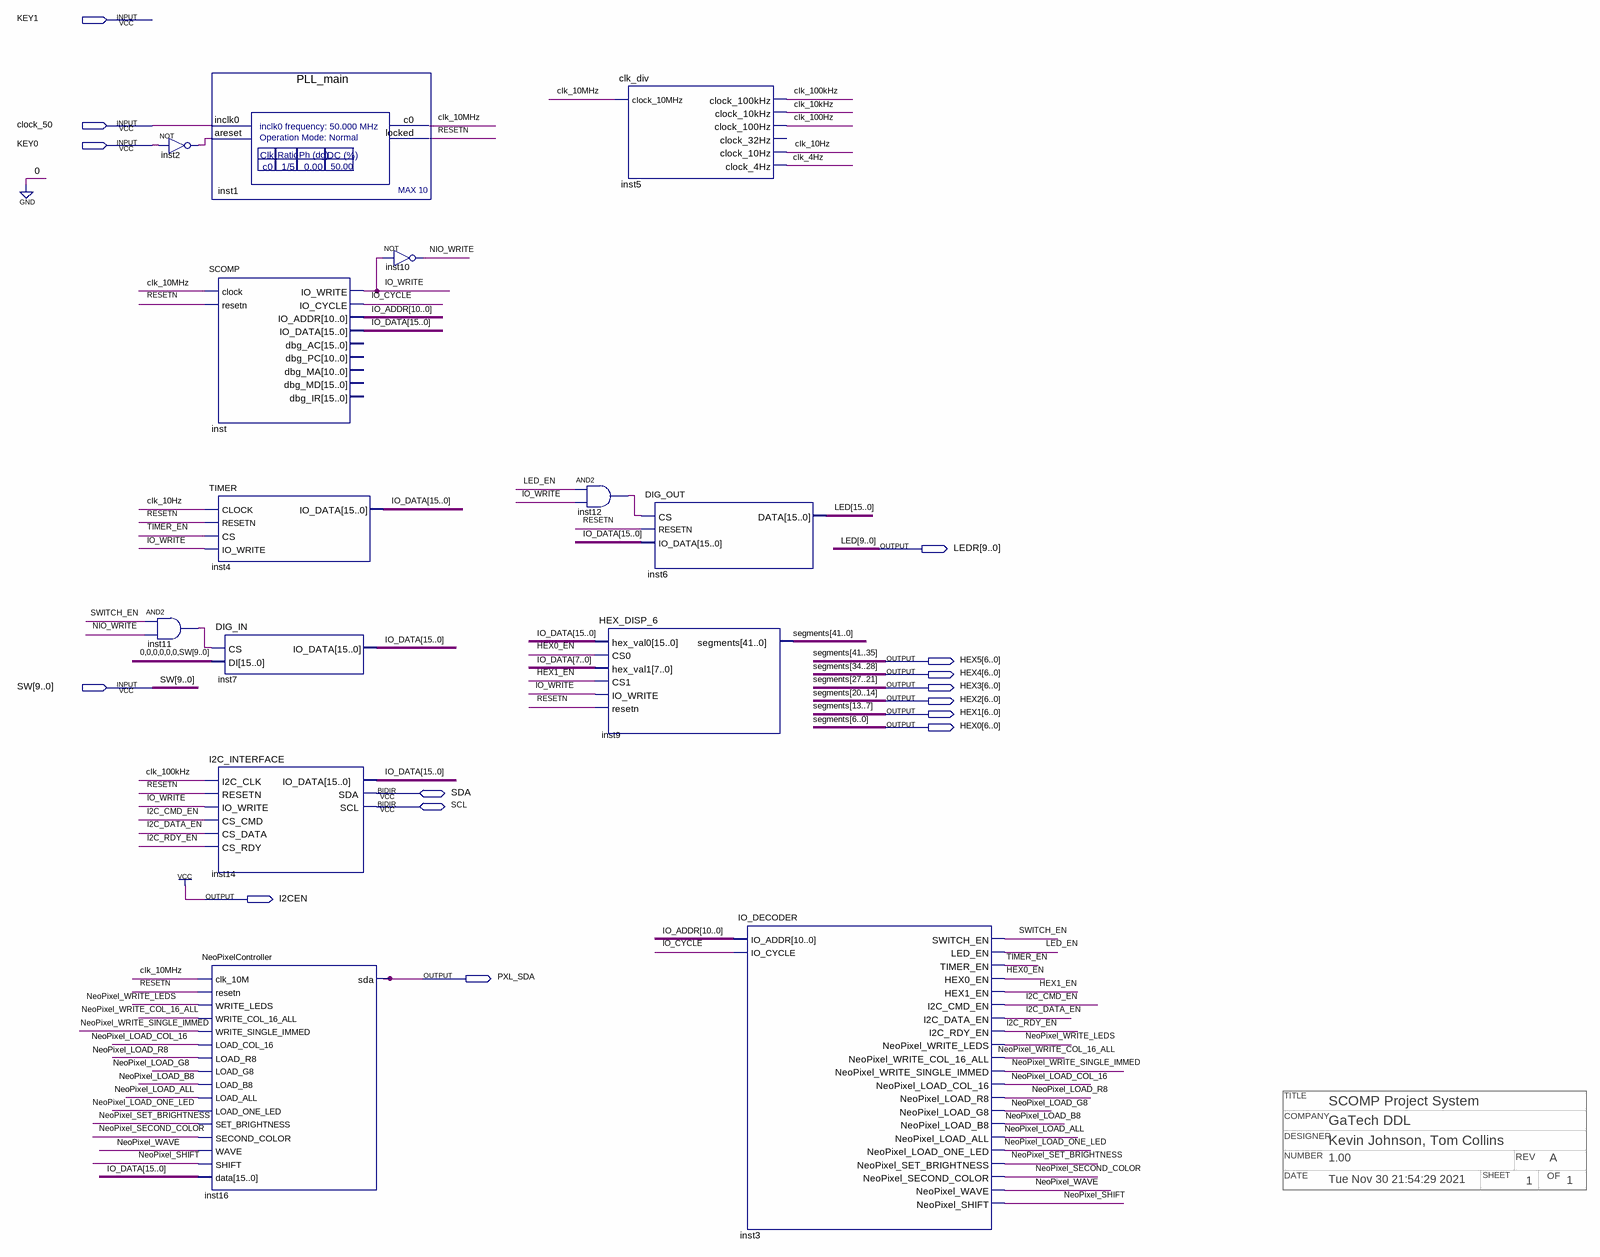
[diagram p0: schematic sheet]
// Quartus schematic SCOMP_System.bdf as structural Verilog: 14 symbols, 15 pins
// Title block: COMPANY: GaTech DDL; DATE: Tue Nov 30 21:54:29 2021; DESIGNER: Kevin Johnson, Tom Collins; NUMBER: 1.00; OF: 1; REV: A; SHEET: 1; TITLE: SCOMP Project System
module SCOMP_System (
  input  KEY1,
  input  clock_50,
  input  KEY0,
  input  [9:0] SW,
  inout  SDA,
  inout  SCL,
  output [9:0] LEDR,
  output [6:0] HEX5,
  output [6:0] HEX4,
  output [6:0] HEX3,
  output [6:0] HEX2,
  output [6:0] HEX1,
  output [6:0] HEX0,
  output I2CEN,
  output PXL_SDA
);

  wire clk_4Hz, clk_10Hz, clk_10kHz, clk_10MHz, clk_100Hz, clk_100kHz, HEX0_EN, HEX1_EN, I2C_CMD_EN,
       I2C_DATA_EN, I2C_RDY_EN, inst2_out, inst11_out, inst12_out, IO_CYCLE, IO_WRITE, LED_EN,
       NeoPixel_LOAD_ALL, NeoPixel_LOAD_B8, NeoPixel_LOAD_COL_16, NeoPixel_LOAD_G8, NeoPixel_LOAD_ONE_LED,
       NeoPixel_LOAD_R8, NeoPixel_SECOND_COLOR, NeoPixel_SET_BRIGHTNESS, NeoPixel_SHIFT, NeoPixel_WAVE,
       NeoPixel_WRITE_COL_16_ALL, NeoPixel_WRITE_LEDS, NeoPixel_WRITE_SINGLE_IMMED, NIO_WRITE, RESETN,
       SWITCH_EN, TIMER_EN;
  wire [10:0] IO_ADDR;
  wire [15:0] IO_DATA;
  wire [15:10] LED;

  not inst2 (inst2_out, KEY0);
  and inst11 (inst11_out, SWITCH_EN, NIO_WRITE);
  PLL_main inst1 (.inclk0(clock_50), .areset(inst2_out), .c0(clk_10MHz), .locked(RESETN));
  SCOMP inst (
    .clock(clk_10MHz), .resetn(RESETN), .IO_WRITE(IO_WRITE), .IO_CYCLE(IO_CYCLE), .IO_ADDR(IO_ADDR),
    .IO_DATA(IO_DATA));  // open: dbg_AC, dbg_PC, dbg_MA, dbg_MD, dbg_IR
  TIMER inst4 (.CLOCK(clk_10Hz), .RESETN(RESETN), .CS(TIMER_EN), .IO_WRITE(IO_WRITE), .IO_DATA(IO_DATA));
  DIG_IN inst7 (.CS(inst11_out), .DI({{6{1'b0}}, SW}), .IO_DATA(IO_DATA));
  I2C_INTERFACE inst14 (
    .I2C_CLK(clk_100kHz), .RESETN(RESETN), .IO_WRITE(IO_WRITE), .CS_CMD(I2C_CMD_EN), .CS_DATA(I2C_DATA_EN),
    .CS_RDY(I2C_RDY_EN), .IO_DATA(IO_DATA), .SDA(SDA), .SCL(SCL));
  NeoPixelController inst16 (
    .clk_10M(clk_10MHz), .resetn(RESETN), .WRITE_LEDS(NeoPixel_WRITE_LEDS),
    .WRITE_COL_16_ALL(NeoPixel_WRITE_COL_16_ALL), .WRITE_SINGLE_IMMED(NeoPixel_WRITE_SINGLE_IMMED),
    .LOAD_COL_16(NeoPixel_LOAD_COL_16), .LOAD_R8(NeoPixel_LOAD_R8), .LOAD_G8(NeoPixel_LOAD_G8),
    .LOAD_B8(NeoPixel_LOAD_B8), .LOAD_ALL(NeoPixel_LOAD_ALL), .LOAD_ONE_LED(NeoPixel_LOAD_ONE_LED),
    .SET_BRIGHTNESS(NeoPixel_SET_BRIGHTNESS), .SECOND_COLOR(NeoPixel_SECOND_COLOR), .WAVE(NeoPixel_WAVE),
    .SHIFT(NeoPixel_SHIFT), .data(IO_DATA), .sda(PXL_SDA));
  not inst10 (NIO_WRITE, IO_WRITE);
  and inst12 (inst12_out, LED_EN, IO_WRITE);
  clk_div inst5 (
    .clock_10MHz(clk_10MHz), .clock_100kHz(clk_100kHz), .clock_10kHz(clk_10kHz), .clock_100Hz(clk_100Hz),
    .clock_10Hz(clk_10Hz), .clock_4Hz(clk_4Hz));  // open: clock_32Hz
  HEX_DISP_6 inst9 (
    .hex_val0(IO_DATA), .CS0(HEX0_EN), .hex_val1(IO_DATA[7:0]), .CS1(HEX1_EN), .IO_WRITE(IO_WRITE),
    .resetn(RESETN), .segments({HEX5, HEX4, HEX3, HEX2, HEX1, HEX0}));
  DIG_OUT inst6 (.CS(inst12_out), .RESETN(RESETN), .IO_DATA(IO_DATA), .DATA({LED, LEDR}));
  IO_DECODER inst3 (
    .IO_ADDR(IO_ADDR), .IO_CYCLE(IO_CYCLE), .SWITCH_EN(SWITCH_EN), .LED_EN(LED_EN), .TIMER_EN(TIMER_EN),
    .HEX0_EN(HEX0_EN), .HEX1_EN(HEX1_EN), .I2C_CMD_EN(I2C_CMD_EN), .I2C_DATA_EN(I2C_DATA_EN),
    .I2C_RDY_EN(I2C_RDY_EN), .NeoPixel_WRITE_LEDS(NeoPixel_WRITE_LEDS),
    .NeoPixel_WRITE_COL_16_ALL(NeoPixel_WRITE_COL_16_ALL),
    .NeoPixel_WRITE_SINGLE_IMMED(NeoPixel_WRITE_SINGLE_IMMED), .NeoPixel_LOAD_COL_16(NeoPixel_LOAD_COL_16),
    .NeoPixel_LOAD_R8(NeoPixel_LOAD_R8), .NeoPixel_LOAD_G8(NeoPixel_LOAD_G8),
    .NeoPixel_LOAD_B8(NeoPixel_LOAD_B8), .NeoPixel_LOAD_ALL(NeoPixel_LOAD_ALL),
    .NeoPixel_LOAD_ONE_LED(NeoPixel_LOAD_ONE_LED), .NeoPixel_SET_BRIGHTNESS(NeoPixel_SET_BRIGHTNESS),
    .NeoPixel_SECOND_COLOR(NeoPixel_SECOND_COLOR), .NeoPixel_WAVE(NeoPixel_WAVE),
    .NeoPixel_SHIFT(NeoPixel_SHIFT));

  assign I2CEN = 1'b1;

  // Other names for the same wires on the sheet: LED[9:0] = LEDR;
  //   segments[41:0] = {HEX5, HEX4, HEX3, HEX2, HEX1, HEX0}
endmodule
